# Altium project NTU-BIME-INSECT-Lab-PCB-Homework.PrjPcb
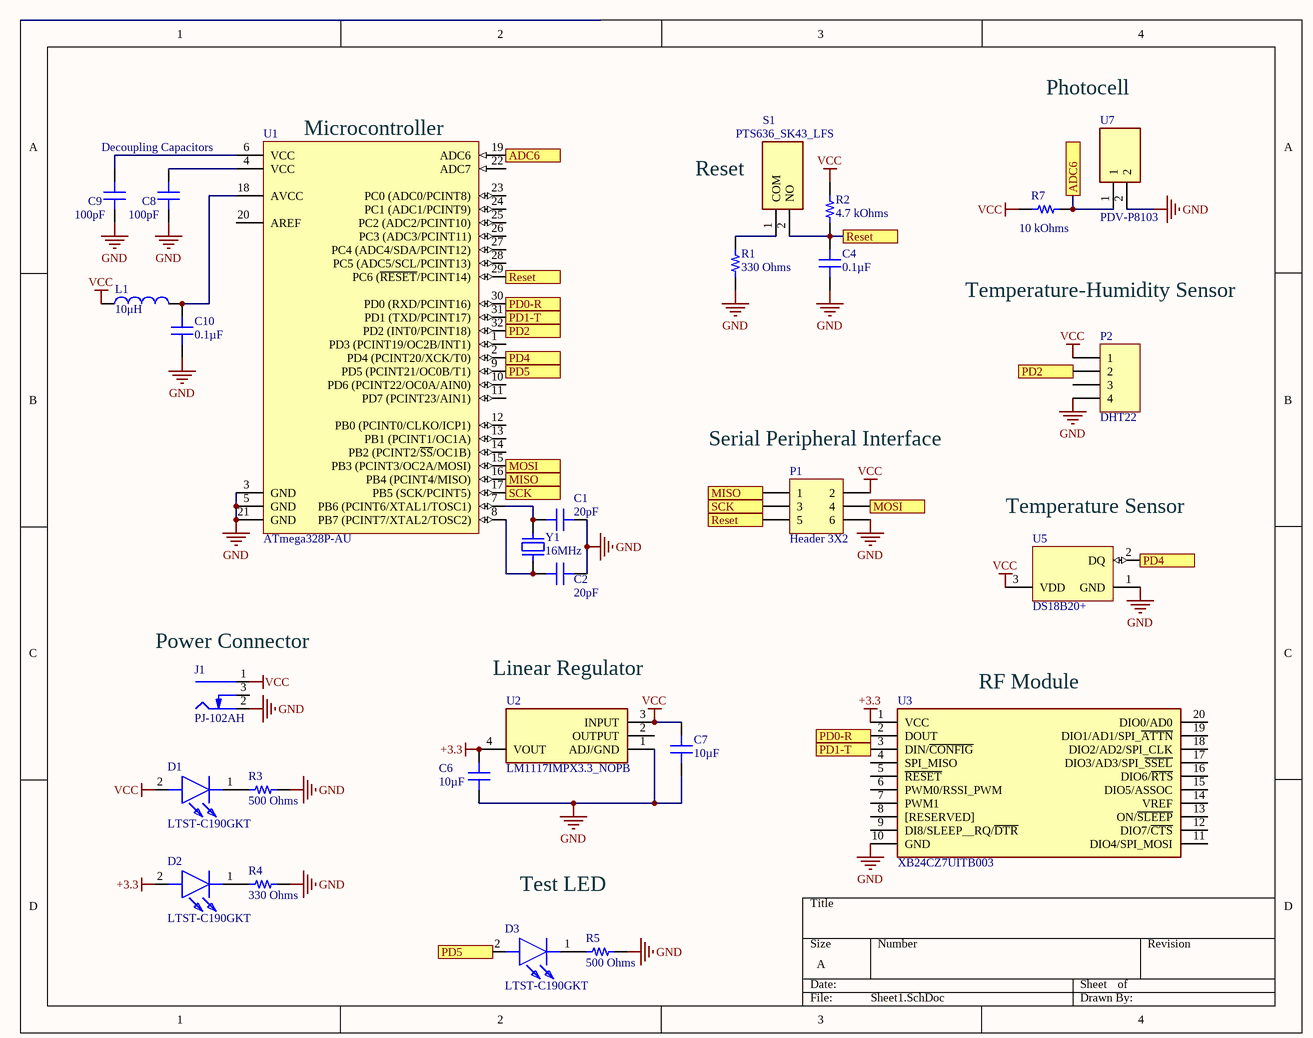
[diagram p0: Sheet1.SchDoc]
1 sheet, 28 parts. Net scope: flat (ports and power ports of the same name join across sheets).
Board file: PCB1.PcbDoc

## Sheet Sheet1.SchDoc
size A

### Parts
C1  20pF  [CAP 0603_1608]
C2  20pF  [CAP 0603_1608]
C4  0.1µF  [CAP 0603_1608]
C6  10µF  [CAP 0603_1608]
C7  10µF  [CAP 0603_1608]
C8  100pF  [CAP 0603_1608]
C9  100pF  [CAP 0603_1608]
C10  0.1µF  [CAP 0603_1608]
D1  LTST-C190GKT  [LEDC1608X90N]
D2  LTST-C190GKT  [LEDC1608X90N]
D3  LTST-C190GKT  [LEDC1608X90N]
J1  PJ-102AH  [CUI PJ-102AH]
L1  10μH  [INDC1608L]
P1  Header 3X2  [HDR2X3]
P2  DHT22  [HDR1X4H]
R1  330 Ohms  [RES 0603_1608]
R2  4.7 kOhms  [RES 0603_1608]
R3  500 Ohms  [RES 0603_1608]
R4  330 Ohms  [RES 0603_1608]
R5  500 Ohms  [RES 0603_1608]
R7  10 kOhms  [RES 0603_1608]
S1  PTS636_SK43_LFS  [PTS636SK43LFS]
U1  ATmega328P-AU  [32A_M]
U2  LM1117IMPX3.3_NOPB  [SOT230P700X180-4N]
U3  XB24CZ7UITB003  [XB24CZ7UITB003]
U5  DS18B20+  [Q3+1]
U7  PDV-P8103  [PDVP8103]
Y1  16MHz  [ABRACON ABLS]

### Ports
ADC6, MISO, MOSI, PD0-R, PD1-T, PD2, PD4, PD5, Reset, SCK

### Nets
+3.3: C6.2 D2.2(A) U2.4(VOUT) U3.1(VCC)
GND: C1.2 C2.2 C4.1 C6.1 C7.1 C8.1 C9.1 C10.1 J1.2(Outer) P1.6 P2.4 R1.1 R3.2 R4.2 R5.2 U1.3(GND) U1.5(GND) U1.21(GND) U2.1(ADJ/GND) U3.10(GND) U5.1(GND) U7.2
VCC: C7.2 D1.2(A) J1.1(Centre) L1.1 P1.2 P2.1 R2.2 R7.1 U2.3(INPUT) U5.3(VDD)
NetC1_1: C1.1 U1.7(PB6_(PCINT6/XTAL1/TOSC1)) Y1.1
NetC2_1: C2.1 U1.8(PB7_(PCINT7/XTAL2/TOSC2)) Y1.2
NetC4_2: C4.2 P1.5 R2.1 S1.2(NO) U1.29(PC6_(~{RESET}/PCINT14)) ; port Reset
NetC8_2: C8.2 U1.4(VCC)
NetC9_2: C9.2 U1.6(VCC)
NetC10_2: C10.2 L1.2 U1.18(AVCC)
NetD1_1: D1.1(K) R3.1
NetD2_1: D2.1(K) R4.1
NetD3_1: D3.1(K) R5.1
NetD3_2: D3.2(A) U1.9(PD5_(PCINT21/OC0B/T1)) ; port PD5
NetP1_1: P1.1 U1.16(PB4_(PCINT4/MISO)) ; port MISO
NetP1_3: P1.3 U1.17(PB5_(SCK/PCINT5)) ; port SCK
NetP1_4: P1.4 U1.15(PB3_(PCINT3/OC2A/MOSI)) ; port MOSI
NetP2_2: P2.2 U1.32(PD2_(INT0/PCINT18)) ; port PD2
NetR1_2: R1.2 S1.1(COM)
NetR7_2: R7.2 U1.19(ADC6) U7.1 ; port ADC6
NetU1_2: U1.2(PD4_(PCINT20/XCK/T0)) U5.2(DQ) ; port PD4
NetU1_30: U1.30(PD0_(RXD/PCINT16)) U3.2(DOUT) ; port PD0-R
NetU1_31: U1.31(PD1_(TXD/PCINT17)) U3.3(DIN/~{CONFIG}) ; port PD1-T

Not connected (* = marked no-connect by the designer): J1 3(SW); P2 3; U1 1(PD3_(PCINT19/OC2B/INT1)) 10(PD6_(PCINT22/OC0A/AIN0)) 11(PD7_(PCINT23/AIN1)) 12(PB0_(PCINT0/CLKO/ICP1)) 13(PB1_(PCINT1/OC1A)) 14(PB2_(PCINT2/~{SS}/OC1B)) 20(AREF) 22(ADC7) 23(PC0_(ADC0/PCINT8)) 24(PC1_(ADC1/PCINT9)) 25(PC2_(ADC2/PCINT10)) 26(PC3_(ADC3/PCINT11)) 27(PC4_(ADC4/SDA/PCINT12)) 28(PC5_(ADC5/SCL/PCINT13)); U2 2(OUTPUT); U3 4(SPI_MISO) 5(~{RESET}) 6(PWM0/RSSI_PWM) 7(PWM1) 8([RESERVED]) 9(DI8/SLEEP__RQ/~{DTR}) 11(DIO4/SPI_MOSI) 12(DIO7/~{CTS}) 13(ON/~{SLEEP}) 14(VREF) 15(DIO5/ASSOC) 16(DIO6/~{RTS}) 17(DIO3/AD3/SPI_~{SSEL}) 18(DIO2/AD2/SPI_CLK) 19(DIO1/AD1/SPI_~{ATTN}) 20(DIO0/AD0)

### Notes on the sheet
- Photocell
- Decoupling Capacitors
- (near U1) Microcontroller
- (near S1) Reset
- Temperature-Humidity Sensor
- (near P1) Serial Peripheral Interface
- (near U5) Temperature Sensor
- (near J1) Power Connector
- Linear Regulator
- (near U3) RF Module
- Test LED

### Library data of the parts
C1 C2 = 06033A200JAT2A: CAP CER 20PF 25V C0G/NP0 0603; Manufacturer: AVX Corporation; Temperature Coefficient: C0G, NP0; Tolerance: ±5%; Part Number: 06033A200JAT2A; Value: 20pF; Applications: General Purpose; Capacitance: 20pF; ComponentLink1Description: Datasheet; ComponentLink1URL: http://datasheets.avx.com/C0GNP0-Dielectric.pdf; ComponentLink2Description: DigiKey Link; ComponentLink2URL: http://digikey.com/product-detail/en/avx-corporation/06033A200JAT2A/478-11802-1-ND/8573438; Device Package: 0603 (1608 Metric); LastUpdated: 9/2/2020 1:03:34 AM; Lifecycle Status: Active; Minimum Order: 1; Mounting Type: Surface Mount, MLCC; Operating Temperature: -55°C ~ 125°C; Package / Case: 0603 (1608 Metric); Packaging: TapeAndReel; PartId: 3067; Part Status: Active; Price: 0.04; Series: -; Size / Dimension: 0.063" L x 0.032" W (1.60mm x 0.81mm); Supplier 1: DigiKey; Supplier Part Number 1: 478-11802-1-ND; Thickness (Max): 0.035" (0.90mm); Voltage - Rated: 25V
C4 = 06033C104MAT4A: CAP CER 0.1UF 25V X7R 0603; Manufacturer: AVX Corporation; Tolerance: ±20%; Part Number: 06033C104MAT4A; Value: 0.1µF; Applications: General Purpose; Capacitance: 0.1µF; ComponentLink1Description: Datasheet; ComponentLink1URL: http://datasheets.avx.com/X7RDielectric.pdf; ComponentLink2Description: DigiKey Link; ComponentLink2URL: http://digikey.com/product-detail/en/avx-corporation/06033C104MAT4A/478-12458-1-ND/9749310; Device Package: 0603 (1608 Metric); LastUpdated: 9/2/2020 1:02:57 AM; Lifecycle Status: Active; Minimum Order: 1; Mounting Type: Surface Mount, MLCC; Operating Temperature: -55°C ~ 125°C; Package / Case: 0603 (1608 Metric); Packaging: TapeAndReel; PartId: 26210; Part Status: Active; Price: 0.07; Series: -; Supplier 1: DigiKey; Supplier Part Number 1: 478-12458-1-ND; Temperature Coefficient: X7R; Voltage - Rated: 25V
C6 C7 = GRM188R60J106ME47D: CAP CER 10UF 6.3V X5R 0603; Manufacturer: Murata Electronics; Tolerance: ±20%; Part Number: GRM188R60J106ME47D; Value: 10µF; Applications: General Purpose; Capacitance: 10µF; ComponentLink1Description: Datasheet; ComponentLink1URL: https://www.murata.com/~/media/webrenewal/support/library/catalog/products/capacitor/mlcc/c02e.ashx?la=en-us; ComponentLink2Description: DigiKey Link; ComponentLink2URL: http://digikey.com/product-detail/en/murata-electronics/GRM188R60J106ME47D/490-3896-1-ND/965938; Device Package: 0603 (1608 Metric); LastUpdated: 9/2/2020 1:03:35 AM; Lifecycle Status: Active; Minimum Order: 1; Mounting Type: Surface Mount, MLCC; Operating Temperature: -55°C ~ 85°C; Package / Case: 0603 (1608 Metric); Packaging: TapeAndReel; PartId: 2351; Part Status: Active; Price: 0.03; Series: GRM; Size / Dimension: 0.063" L x 0.031" W (1.60mm x 0.80mm); Supplier 1: DigiKey; Supplier Part Number 1: 490-3896-1-ND; Temperature Coefficient: X5R; Thickness (Max): 0.035" (0.90mm); Voltage - Rated: 6.3V
C8 C9 = C0603C101K5GACAUTO: CAP CER 100PF 50V C0G/NP0 0603; Manufacturer: KEMET; Temperature Coefficient: C0G, NP0; Tolerance: ±10%; Part Number: C0603C101K5GACAUTO; Value: 100pF; Applications: Automotive; Capacitance: 100pF; ComponentLink1Description: Datasheet; ComponentLink1URL: https://api.kemet.com/component-edge/download/datasheet/C0603C101K5GACAUTO.pdf; ComponentLink2Description: DigiKey Link; ComponentLink2URL: http://digikey.com/product-detail/en/kemet/C0603C101K5GACAUTO/399-6843-1-ND/3314358; Device Package: 0603 (1608 Metric); Features: Low ESL; LastUpdated: 9/2/2020 1:03:36 AM; Lifecycle Status: Active; Minimum Order: 1; Mounting Type: Surface Mount, MLCC; Operating Temperature: -55°C ~ 125°C; Package / Case: 0603 (1608 Metric); Packaging: TapeAndReel; PartId: 2201; Part Status: Active; Price: 0.02; Ratings: AEC-Q200; Series: SMD Auto C0G; Size / Dimension: 0.063" L x 0.031" W (1.60mm x 0.80mm); Supplier 1: DigiKey; Supplier Part Number 1: 399-6843-1-ND; Thickness (Max): 0.034" (0.87mm); Voltage - Rated: 50V
C10 = C0603T104K8RAC7867: CAP CER 0.1UF 10V X7R 0603; Manufacturer: KEMET; Ratings: COTS; Tolerance: ±10%; Part Number: C0603T104K8RAC7867; Value: 0.1µF; Applications: High Reliability, Bypass, Decoupling; Capacitance: 0.1µF; ComponentLink1Description: Datasheet; ComponentLink1URL: https://api.kemet.com/component-edge/download/datasheet/C0603T104K8RAC7867.pdf; ComponentLink2Description: DigiKey Link; ComponentLink2URL: http://digikey.com/product-detail/en/kemet/C0603T104K8RAC7867/399-20424-1-ND/9925028; Device Package: 0603 (1608 Metric); LastUpdated: 9/2/2020 1:03:35 AM; Lifecycle Status: Active; Minimum Order: 1; Mounting Type: Surface Mount, MLCC; Operating Temperature: -55°C ~ 125°C; Package / Case: 0603 (1608 Metric); Packaging: TapeAndReel; PartId: 2528; Part Status: Active; Price: 0.23; Series: SMD COTS X7R; Size / Dimension: 0.063" L x 0.031" W (1.60mm x 0.80mm); Supplier 1: DigiKey; Supplier Part Number 1: 399-20424-1-ND; Temperature Coefficient: X7R; Thickness (Max): 0.034" (0.87mm); Voltage - Rated: 10V
D1-D3 = LTST-C190GKT: LED; Manufacturer_Name: Lite-On; Datasheet Link: https://media.digikey.com/pdf/Data%20Sheets/Lite-On%20PDFs/LTST-C190GKT.pdf; Height: 0.9mm; Manufacturer_Part_Number: LTST-C190GKT; Arrow Part Number: LTST-C190GKT; Arrow Price/Stock: https://www.arrow.com/en/products/ltst-c190gkt/lite-on-technology; Mouser Part Number: 859-LTST-C190GKT; Mouser Price/Stock: https://www.mouser.co.uk/ProductDetail/Lite-On/LTST-C190GKT?qs=drxkyCeiWgbQzclgbojDOg%3D%3D
J1 = PJ-102AH: CONN PWR JACK 2X5.5MM SOLDER; Manufacturer: CUI Devices; Actual Diameter: 0.079" (2.00mm ID), 0.256" (6.50mm OD); Current Rating (Amps): 5A; Gender: Male; Industry Recognized Mating Diameter: 2.00mm ID (0.079"), 5.50mm OD (0.217"); Internal Switch(s): Single Switch, Normally Closed; Material Flammability Rating: UL94 V-0; Mating Length/Depth: 0.354" (9.00mm); Number of Positions/Contacts: 2 Conductors, 3 Contacts; Shielding: Unshielded; Voltage - Rated: 24VDC; Part Number: PJ-102AH; ComponentLink1Description: Datasheet; ComponentLink1URL: https://www.cuidevices.com/product/resource/digikeypdf/pj-102ah.pdf; ComponentLink2Description: DigiKey Link; ComponentLink2URL: //digikey.com/product-detail/en/cui-devices/PJ-102AH/CP-102AH-ND/408448; Connector Type: Jack; LastUpdated: 12/16/2019 7:01:27 PM; Lifecycle Status: 0; Minimum Order: 1; Mounting Type: Through Hole, Right Angle; Packaging: Tray; Part Status: Active; Price: 0.76; Series: -; Supplier 1: DigiKey; Supplier Part Number 1: CP-102AH-ND; Termination: Solder
L1 = Inductor: Code_IEC: 1005; Published: 8-Jun-2000; LatestRevisionDate: 29-May-2009; LatestRevisionNote: IPC-7351 Footprint Added.; PackageReference: 0402-A; Publisher: Altium Limited; PackageDescription: Chip Inductor; Code_JEITA: 0402; Value: 10μH
P1 = Header 3X2: Header, 3-Pin, Dual row; LatestRevisionDate: 17-Jul-2002; LatestRevisionNote: Re-released for DXP Platform.; Publisher: Altium Limited
P2 = Header 4H: Header, 4-Pin, Right Angle; LatestRevisionDate: 17-Jul-2002; LatestRevisionNote: Re-released for DXP Platform.; Publisher: Altium Limited
R1 R4 = CRGP0603F330R: CRGP 0603 330R 1%; Manufacturer: TE Connectivity Passive Product; Power (Watts): 0.25W, 1/4W; Temperature Coefficient: ±100ppm/°C; Part Number: CRGP0603F330R; Value: 330 Ohms; ComponentLink1Description: Datasheet; ComponentLink1URL: https://www.te.com/commerce/DocumentDelivery/DDEController?Action=srchrtrv&DocNm=9-1773463-9&DocType=DS&DocLang=English; ComponentLink2Description: DigiKey Link; ComponentLink2URL: http://digikey.com/product-detail/en/te-connectivity-passive-product/CRGP0603F330R/A130410CT-ND/8578242; Composition: Thick Film; Device Package: 0603 (1608 Metric); Features: Pulse Withstanding; Height - Seated (Max): 0.022" (0.55mm); LastUpdated: 9/2/2020 1:09:50 AM; Lifecycle Status: Active; Minimum Order: 1; Number of Terminations: 2; Operating Temperature: -55°C ~ 155°C; Package / Case: 0603 (1608 Metric); Packaging: TapeAndReel; PartId: 20927; Part Status: Active; Price: 0.02; Resistance: 330 Ohms; Series: CRGP; Size / Dimension: 0.063" L x 0.031" W (1.60mm x 0.80mm); Supplier 1: DigiKey; Supplier Part Number 1: A130410CT-ND; Supplier Device Package: 0603; Tolerance: ±1%
R2 = ERA-3AEB472V: RES SMD 4.7K OHM 0.1% 1/10W 0603; Manufacturer: Panasonic Electronic Components; Power (Watts): 0.1W, 1/10W; Temperature Coefficient: ±25ppm/°C; Part Number: ERA-3AEB472V; Value: 4.7 kOhms; ComponentLink1Description: Datasheet; ComponentLink1URL: https://industrial.panasonic.com/cdbs/www-data/pdf/RDM0000/AOA0000C307.pdf; ComponentLink2Description: DigiKey Link; ComponentLink2URL: http://digikey.com/product-detail/en/panasonic-electronic-components/ERA-3AEB472V/P4.7KDBCT-ND/1466068; Composition: Thin Film; Device Package: 0603 (1608 Metric); Features: Automotive AEC-Q200; Height - Seated (Max): 0.022" (0.55mm); LastUpdated: 9/2/2020 1:10:23 AM; Lifecycle Status: Active; Minimum Order: 1; Number of Terminations: 2; Operating Temperature: -55°C ~ 155°C; Package / Case: 0603 (1608 Metric); Packaging: TapeAndReel; PartId: 5519; Part Status: Active; Price: 0.04; Ratings: AEC-Q200; Resistance: 4.7 kOhms; Series: ERA-3A; Size / Dimension: 0.063" L x 0.031" W (1.60mm x 0.80mm); Supplier 1: DigiKey; Supplier Part Number 1: P4.7KDBCT-ND; Supplier Device Package: 0603; Tolerance: ±0.1%
R3 R5 = TNPU0603500RAZEN00: RES SMD 500 OHM 0.05% 1/10W 0603; Manufacturer: Vishay Dale; Power (Watts): 0.1W, 1/10W; Temperature Coefficient: ±5ppm/°C; Part Number: TNPU0603500RAZEN00; Value: 500 Ohms; ComponentLink1Description: Datasheet; ComponentLink1URL: http://www.vishay.com/docs/28779/tnpue3.pdf; ComponentLink2Description: DigiKey Link; ComponentLink2URL: http://digikey.com/product-detail/en/vishay-dale/TNPU0603500RAZEN00/541-3301-1-ND/6615958; Composition: Thin Film; Device Package: 0603 (1608 Metric); Features: Anti-Sulfur, Automotive AEC-Q200, Moisture Resistant; Height - Seated (Max): 0.022" (0.55mm); LastUpdated: 9/2/2020 1:10:10 AM; Lifecycle Status: Active; Minimum Order: 1; Number of Terminations: 2; Operating Temperature: -55°C ~ 125°C; Package / Case: 0603 (1608 Metric); Packaging: TapeAndReel; PartId: 11840; Part Status: Active; Price: 1.20; Ratings: AEC-Q200; Resistance: 500 Ohms; Series: TNPU; Size / Dimension: 0.063" L x 0.033" W (1.60mm x 0.85mm); Supplier 1: DigiKey; Supplier Part Number 1: 541-3301-1-ND; Supplier Device Package: 0603; Tolerance: ±0.05%
R7 = CPF0603B10KE: RES SMD 10K OHM 0.1% 1/16W 0603; Manufacturer: TE Connectivity Passive Product; Power (Watts): 0.063W, 1/16W; Temperature Coefficient: ±25ppm/°C; Part Number: CPF0603B10KE; Value: 10 kOhms; ComponentLink1Description: Datasheet; ComponentLink1URL: https://www.te.com/commerce/DocumentDelivery/DDEController?Action=srchrtrv&DocNm=1773200&DocType=DS&DocLang=English; ComponentLink2Description: DigiKey Link; ComponentLink2URL: http://digikey.com/product-detail/en/te-connectivity-passive-product/CPF0603B10KE/A119886CT-ND/4966484; Composition: Thin Film; Device Package: 0603 (1608 Metric); Height - Seated (Max): 0.022" (0.55mm); LastUpdated: 9/2/2020 1:10:25 AM; Lifecycle Status: Active; Minimum Order: 1; Number of Terminations: 2; Operating Temperature: -55°C ~ 155°C; Package / Case: 0603 (1608 Metric); Packaging: TapeAndReel; PartId: 4872; Part Status: Active; Price: 0.09; Resistance: 10 kOhms; Series: CPF, Neohm; Size / Dimension: 0.061" L x 0.031" W (1.55mm x 0.80mm); Supplier 1: DigiKey; Supplier Part Number 1: A119886CT-ND; Supplier Device Package: 0603; Tolerance: ±0.1%
S1 = PTS636_SK43_LFS: Switch; Manufacturer_Name: C & K COMPONENTS; Manufacturer_Part_Number: PTS636 SK43 LFS; Datasheet Link: https://componentsearchengine.com/Datasheets/1/PTS636 SK43 LFS.pdf; Height: 4.5mm; Arrow Part Number: PTS636 SK43 LFS; Arrow Price/Stock: https://www.arrow.com/en/products/pts636-sk43-lfs/ck; Mouser Part Number: 611-PTS636SK43LFS; Mouser Price/Stock: https://www.mouser.co.uk/ProductDetail/CK/PTS636-SK43-LFS?qs=vLWxofP3U2yMiQldG7jfnQ%3D%3D
U1 = CMP-0095-00269-2: 8-bit AVR Microcontroller, 32KB Flash, 1KB EEPROM, 2KB SRAM, 32-pin TQFP, Industrial Grade (-40°C to 85°C); PackageDescription: 32-Lead, 7x7x1.0 mm Body, 0.8mm Lead Pitch, Thin Profile Plastic Quad Flat Package (TQFP); DatasheetVersion: revD, May-2011; RevisionNote: DatasheetVersion & PackageVersion updated. URLs added.; ComponentLink1URL: http://www.atmel.com/; ComponentLink2Description: ATmega48A/48PA/88A/88PA/168A/168PA/328/328P Datasheet; Code_JEDEC: MS-026-ABA; ComponentLink1Description: Manufacturer URL; PackageReference: 32A; ComponentLink3Description: ATmega48A/48PA/88A/88PA/168A/168PA/328/328P Summary; ComponentLink2URL: http://www.atmel.com/dyn/resources/prod_documents/doc8271.pdf; PackageVersion: revC, Oct-2010; ComponentLink3URL: http://www.atmel.com/dyn/resources/prod_documents/8271S.pdf
U2 = LM1117IMPX3.3_NOPB: Integrated Circuit; Manufacturer_Name: Texas Instruments; Manufacturer_Part_Number: LM1117IMPX3.3/NOPB; Datasheet Link: http://www.ti.com/lit/ds/symlink/lm1117.pdf; Height: 1.8mm
U3 = XB24CZ7UITB003: Integrated Circuit; Manufacturer_Name: Digi International; Datasheet Link: https://www.digi.com/resources/documentation/digidocs/pdfs/90001500.pdf; Height: 7.874mm; Manufacturer_Part_Number: XB24CZ7UITB003; Arrow Part Number: XB24CZ7UITB003; Arrow Price/Stock: https://www.arrow.com/en/products/xb24cz7uitb003/digi-international; Mouser Part Number: 888-XB24CZ7UITB003; Mouser Price/Stock: https://www.mouser.com/Search/Refine.aspx?Keyword=888-XB24CZ7UITB003
U5 = CMP-0253-00003-1: Programmable Resolution Digital Thermometer, 1-Wire Interface, ±0.5°C Accuracy, 3-Pin TO92, -55°C to +125°C, Pb-Free; ComponentLink2URL: http://datasheets.maxim-ic.com/en/ds/DS18B20.pdf; PackageReference: Q3+1; ComponentLink1Description: Manufacturer URL; PackageDescription: TO-92 Package, Body Dia. 4.7mm; Leads 0.51 x 0.51 mm (max), Pb-Free; DatasheetVersion: 2007; Code_JEDEC: TO-226-AA; ComponentLink1URL: http://www.maxim-ic.com; PackageVersion: revB, 2009; ComponentLink2Description: Datasheet
U7 = PDV-P8103: Integrated Circuit; Manufacturer_Name: Luna Optoelectronics; Datasheet Link: https://datasheet.datasheetarchive.com/originals/dk/DKDS-5/85880.pdf; Height: 2.38mm; Manufacturer_Part_Number: PDV-P8103
Y1 = ABLS-16.000MHZ-B2-T: CRYSTAL 16.0000MHZ 18PF SMD; Manufacturer: Abracon LLC; ESR (Equivalent Series Resistance): 40 Ohms; Frequency Stability: ±50ppm; Frequency Tolerance: ±20ppm; Operating Mode: Fundamental; Part Number: ABLS-16.000MHZ-B2-T; ComponentLink1Description: Datasheet; ComponentLink1URL: https://abracon.com/Resonators/abls.pdf; ComponentLink2Description: DigiKey Link; ComponentLink2URL: http://digikey.com/product-detail/en/abracon-llc/ABLS-16.000MHZ-B2-T/535-9071-1-ND/675588; Frequency: 16MHz; Height - Seated (Max): 0.165" (4.20mm); LastUpdated: 9/2/2020 1:21:45 AM; Lifecycle Status: Active; Load Capacitance: 18pF; Minimum Order: 1; Mounting Type: Surface Mount; Operating Temperature: -20°C ~ 70°C; Package / Case: HC-49/US; Packaging: TapeAndReel; PartId: 132; Part Status: Active; Price: 0.24; Series: ABLS; Size / Dimension: 0.449" L x 0.185" W (11.40mm x 4.70mm); Supplier 1: DigiKey; Supplier Part Number 1: 535-9071-1-ND; Type: MHz Crystal; Value: 16MHz